# EAGLE schematic Strain_Gauges_Amplifier_SMD (EAGLE 7.6.0)
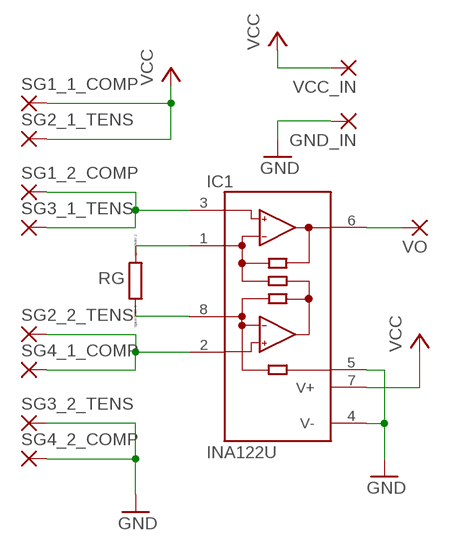
[diagram p0: schematic, sheet 1]

## Parts
GND_IN  SMD2  [SMD1,27-2,54]
IC1  INA122U  [SO08]
RG  R  [R0805]
SG1_1_COMP  SMD2  [SMD1,27-2,54]
SG1_2_COMP  SMD2  [SMD1,27-2,54]
SG2_1_TENS  SMD2  [SMD1,27-2,54]
SG2_2_TENS  SMD2  [SMD1,27-2,54]
SG3_1_TENS  SMD2  [SMD1,27-2,54]
SG3_2_TENS  SMD2  [SMD1,27-2,54]
SG4_1_COMP  SMD2  [SMD1,27-2,54]
SG4_2_COMP  SMD2  [SMD1,27-2,54]
VCC_IN  SMD2  [SMD1,27-2,54]
VO  SMD2  [SMD1,27-2,54]

## Nets
GND: GND_IN.1(P) IC1.4(V-) IC1.5(REF) SG3_2_TENS.1(P) SG4_2_COMP.1(P)
N$1: IC1.1(RG) RG.2
N$2: IC1.8(RG) RG.1
N$3: IC1.3(+IN) SG1_2_COMP.1(P) SG3_1_TENS.1(P)
N$5: IC1.2(-IN) SG2_2_TENS.1(P) SG4_1_COMP.1(P)
VCC: IC1.7(V+) SG1_1_COMP.1(P) SG2_1_TENS.1(P) VCC_IN.1(P)
VO: IC1.6(OUT) VO.1(P)

## Library data of the parts
GND_IN SG1_1_COMP SG1_2_COMP SG2_1_TENS SG2_2_TENS SG3_1_TENS SG3_2_TENS SG4_1_COMP SG4_2_COMP VCC_IN VO = wirepad:SMD2: SMD PAD
IC1 = burr-brown:INA122: Instrumentation Amplifier Single Supply, MicroPower; MPN: INA122U; OC_FARNELL: 1212407; OC_NEWARK: 97K1918
RG = eagle-ltspice:R: RESISTOR, European symbol; SPICEMODEL: NONE; SPICEPREFIX: R